# EAGLE design 612_jetracer_328 (EAGLE 9.6.2)
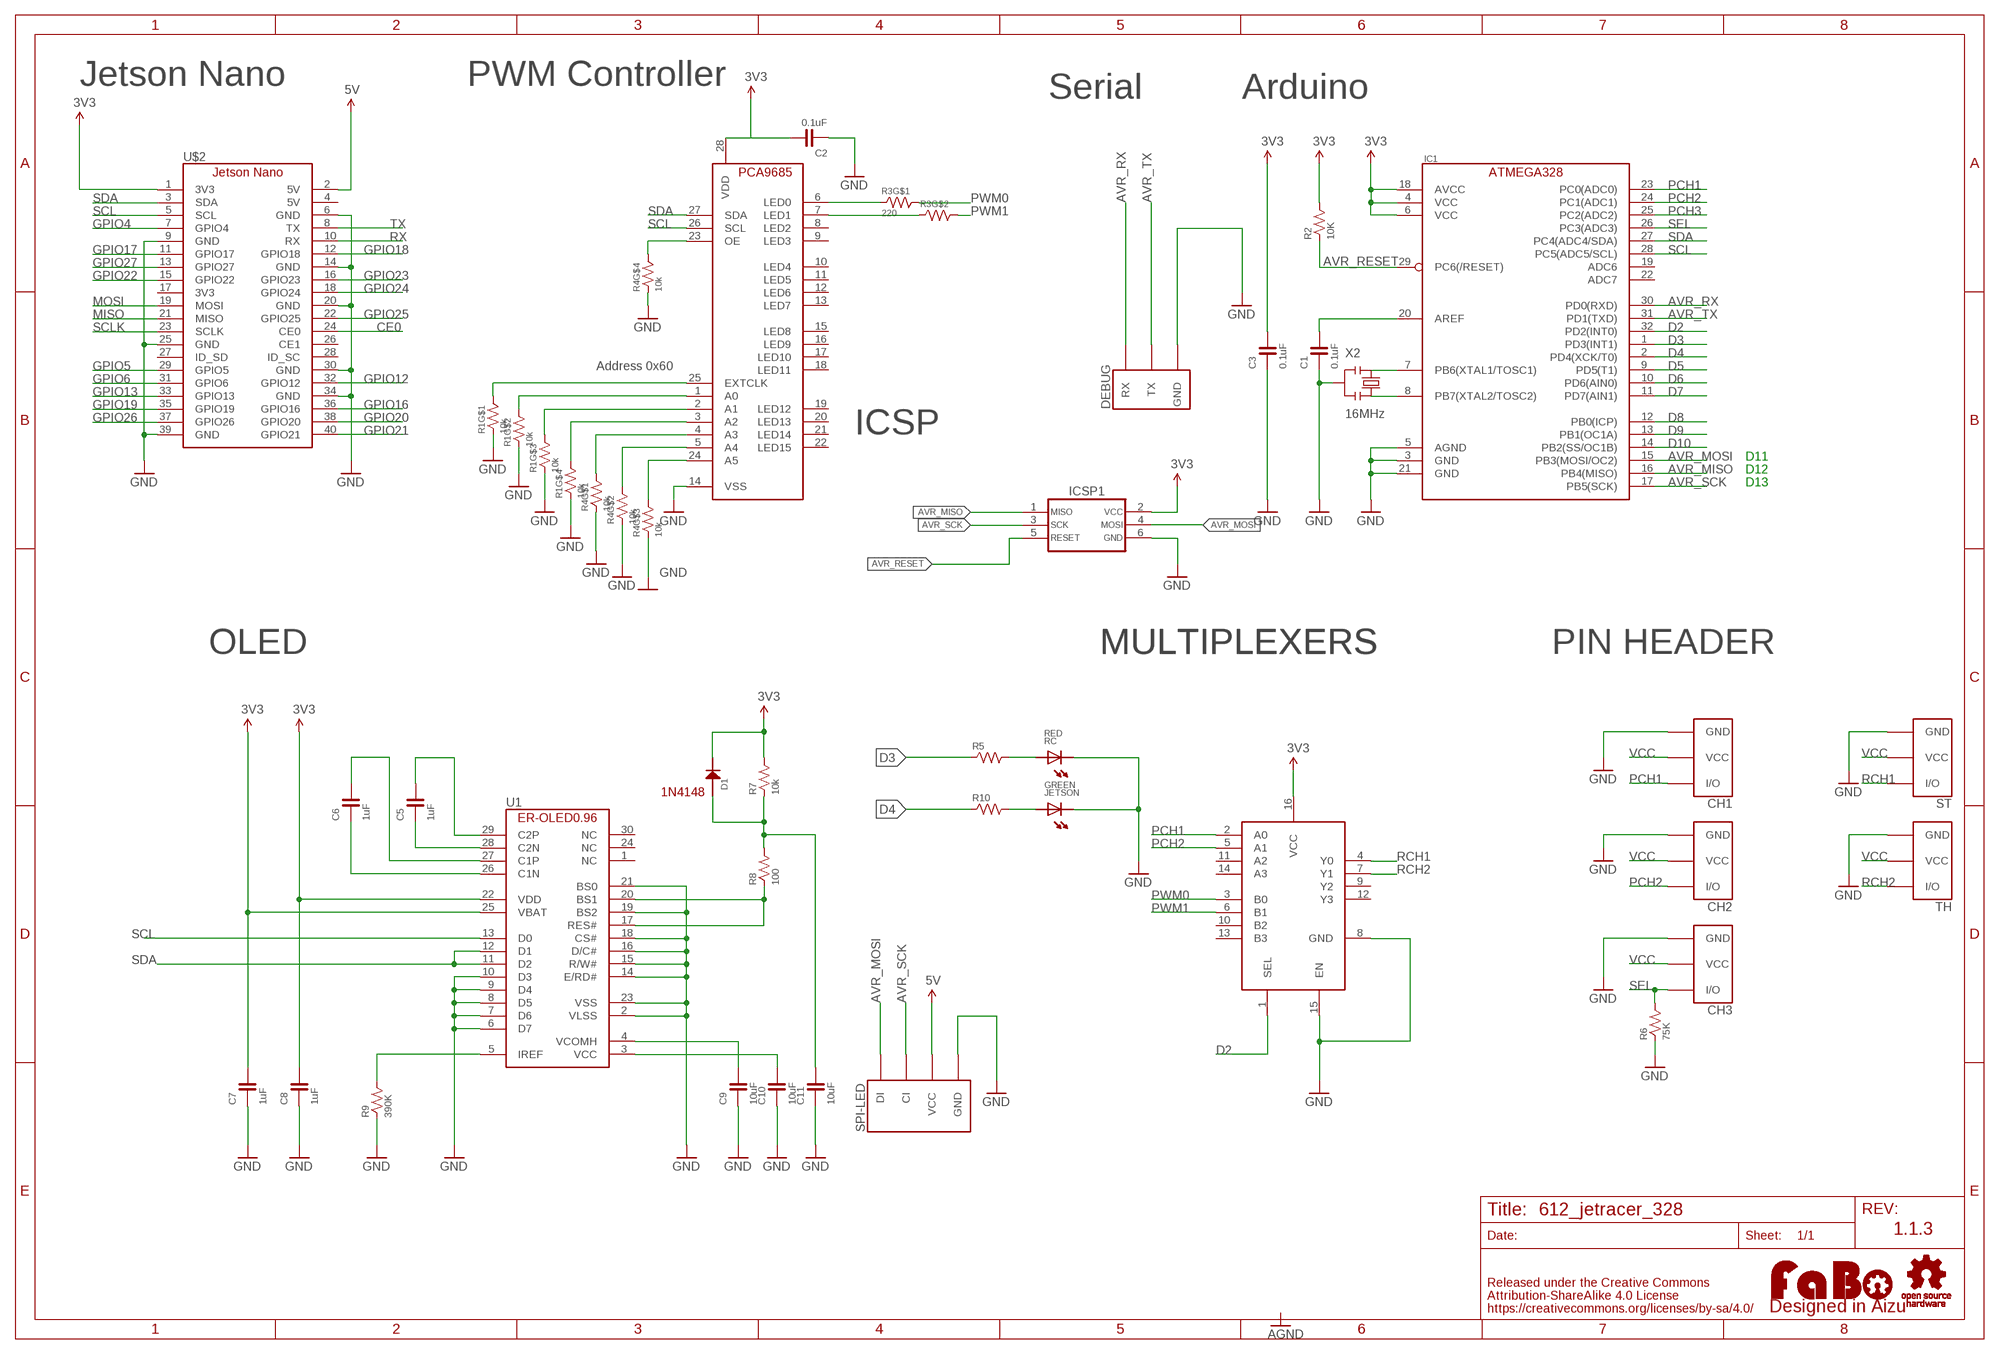
[diagram p0: schematic, sheet 1]

## Parts
C1  0.1uF  CAPACITOR-0603  [0603]
C2  0.1uF  CAPACITOR-0603  [0603]
C3  0.1uF  CAPACITOR-0603  [0603]
C5  1uF  CAPACITOR-0603-BOTTOM  [0603-BOTTOM]
C6  1uF  CAPACITOR-0603-BOTTOM  [0603-BOTTOM]
C7  1uF  CAPACITOR-0603-BOTTOM  [0603-BOTTOM]
C8  1uF  CAPACITOR-0603-BOTTOM  [0603-BOTTOM]
C9  10uF  CAPACITOR-0603-BOTTOM  [0603-BOTTOM]
C10  10uF  CAPACITOR-0603-BOTTOM  [0603-BOTTOM]
C11  10uF  CAPACITOR-0603-BOTTOM  [0603-BOTTOM]
CH1  FABO_BRICK_3PIN-HEADER  [FABO_BRICK_3PIN_HEADER]
CH2  FABO_BRICK_3PIN-HEADER  [FABO_BRICK_3PIN_HEADER]
CH3  FABO_BRICK_3PIN-HEADER  [FABO_BRICK_3PIN_HEADER]
D1  1N4148  [1N4148W]
DEBUG  FABO_BRICK_3PIN_DEBUG  [FABO_BRICK_3PIN_DEBUG]
IC1  ATMEGA328P-AU  [TQFP-32]
IC3  MULTIPLEXERSMC74HC157A  [TSSOP-16]
ICSP1  ICSP_AVR-TC_NOHOLE  [TC2030]
JETSON  GREEN  LED-0603  [0603]
LOGO1  LOGO_FABO-S  [LOGO_FABO_S]
R1  10k  RESISTOR_ARRAY  [EXBV8V]
R2  10K  RESISTOR-0603  [0603]
R3  220  RESISTOR_ARRAY  [EXBV8V]
R4  10k  RESISTOR_ARRAY  [EXBV8V]
R5  220  RESISTOR-0603  [0603]
R6  75K  RESISTOR-0603  [0603]
R7  10k  RESISTOR-0603-BOTTOM  [0603-BOTTOM]
R8  100  RESISTOR-0603-BOTTOM  [0603-BOTTOM]
R9  390K  RESISTOR-0603-BOTTOM  [0603-BOTTOM]
R10  220  RESISTOR-0603  [0603]
RC  RED  LED-0603  [0603]
SPI-LED  FABO-SPI-LED-B04B  [SPI-B04B-PASK-1]
ST  FABO_BRICK_3PIN-HEADER  [FABO_BRICK_3PIN_HEADER]
TH  FABO_BRICK_3PIN-HEADER  [FABO_BRICK_3PIN_HEADER]
U1  ER-OLED0.96-1ER-CON30HT-1  [ER-CON30HT-1]
U$2  JETSON_NANO_NOBORDER  [JETSON_NANO_NOBOARDER]
U$3  PCA9685_BOTTOM  [PCA9685_BOTTOM]
U$7  LOGO_OSHW-M_BOTTOM  [LOGO_OSHW_M_BOTTOM]
X2  16MHz  RESONATOR  [CSTNE_V_C]

## Nets
3V3: C2.2 C3.2 C7.2 D1.CATHODE IC1.4(VCC) IC1.6(VCC) IC1.18(AVCC) IC3.16(VCC) ICSP1.2 R2.2 R7.2 U1.25(VBAT) U$2.1(3V3) U$3.28(VDD)
5V: SPI-LED.VCC U$2.2(5V)
AVR_MISO: IC1.16(PB4(MISO)) ICSP1.1
AVR_MOSI: IC1.15(PB3(MOSI/OC2)) ICSP1.4 SPI-LED.DI
AVR_RESET: IC1.29(PC6(/RESET)) ICSP1.5 R2.1
AVR_RX: DEBUG.RX IC1.30(PD0(RXD))
AVR_SCK: IC1.17(PB5(SCK)) ICSP1.3 SPI-LED.CI
AVR_TX: DEBUG.TX IC1.31(PD1(TXD))
CE0: U$2.24(CE0)
D2: IC1.32(PD2(INT0)) IC3.1(SEL)
D3: IC1.1(PD3(INT1)) R5.1
D4: IC1.2(PD4(XCK/T0)) R10.1
D5: IC1.9(PD5(T1))
D6: IC1.10(PD6(AIN0))
D7: IC1.11(PD7(AIN1))
D8: IC1.12(PB0(ICP))
D9: IC1.13(PB1(OC1A))
D10: IC1.14(PB2(SS/OC1B))
GND: C1.1 C2.1 C3.1 C7.1 C8.1 C9.1 C10.1 C11.1 CH1.GND CH2.GND CH3.GND DEBUG.GND IC1.3(GND) IC1.5(AGND) IC1.21(GND) IC3.8(GND) IC3.15(EN) ICSP1.6 JETSON.CATHODE R1.1 R1.2 R1.3 R1.4 R4.1 R4.2 R4.3 R4.4 R6.1 R9.1 RC.CATHODE SPI-LED.GND ST.GND TH.GND U1.2(VLSS) U1.6(D7) U1.7(D6) U1.8(D5) U1.9(D4) U1.10(D3) U1.14(E/RD#) U1.15(R/W#) U1.16(D/C#) U1.18(CS#) U1.19(BS2) U1.21(BS0) U1.23(VSS) U$2.6(GND) U$2.9(GND) U$2.14(GND) U$2.20(GND) U$2.25(GND) U$2.30(GND) U$2.34(GND) U$2.39(GND) U$3.14(VSS) X2.2
GPIO4: U$2.7(GPIO4)
GPIO5: U$2.29(GPIO5)
GPIO6: U$2.31(GPIO6)
GPIO12: U$2.32(GPIO12)
GPIO13: U$2.33(GPIO13)
GPIO16: U$2.36(GPIO16)
GPIO17: U$2.11(GPIO17)
GPIO18: U$2.12(GPIO18)
GPIO19: U$2.35(GPIO19)
GPIO20: U$2.38(GPIO20)
GPIO21: U$2.40(GPIO21)
GPIO22: U$2.15(GPIO22)
GPIO23: U$2.16(GPIO23)
GPIO24: U$2.18(GPIO24)
GPIO25: U$2.22(GPIO25)
GPIO26: U$2.37(GPIO26)
GPIO27: U$2.13(GPIO27)
MISO: U$2.21(MISO)
MOSI: U$2.19(MOSI)
N$2: R3.1 U$3.6(LED0)
N$3: R3.2 U$3.7(LED1)
N$4: C1.2 IC1.20(AREF)
N$5: IC1.8(PB7(XTAL2/TOSC2)) X2.3
N$7: R4.5 U$3.23(OE)
N$8: R1.8 U$3.25(EXTCLK)
N$9: R1.7 U$3.1(A0)
N$10: R1.6 U$3.2(A1)
N$11: R1.5 U$3.3(A2)
N$12: R4.8 U$3.4(A3)
N$13: R4.7 U$3.5(A4)
N$14: R4.6 U$3.24(A5)
N$15: IC1.7(PB6(XTAL1/TOSC1)) X2.1
N$16: C6.2 U1.27(C1P)
N$19: R5.2 RC.ANODE
N$20: JETSON.ANODE R10.2
N$21: C6.1 U1.26(C1N)
N$22: C5.1 U1.28(C2N)
N$23: C5.2 U1.29(C2P)
N$24: R9.2 U1.5(IREF)
N$25: C9.2 U1.4(VCOMH)
N$26: C10.2 U1.3(VCC)
N$27: R8.1 U1.17(RES#) U1.20(BS1)
N$28: C11.2 D1.ANODE R7.1 R8.2
N$30: C8.2 U1.22(VDD) ; supply symbol labelled 3V3
PCH1: CH1.I/O IC1.23(PC0(ADC0)) IC3.2(A0)
PCH2: CH2.I/O IC1.24(PC1(ADC1)) IC3.5(A1)
PCH3: IC1.25(PC2(ADC2))
PWM0: IC3.3(B0) R3.8
PWM1: IC3.6(B1) R3.7
RCH1: IC3.4(Y0) ST.I/O
RCH2: IC3.7(Y1) TH.I/O
RX: U$2.10(RX)
SCL: IC1.28(PC5(ADC5/SCL)) U1.13(D0) U$2.5(SCL) U$3.26(SCL)
SCLK: U$2.23(SCLK)
SDA: IC1.27(PC4(ADC4/SDA)) U1.11(D2) U1.12(D1) U$2.3(SDA) U$3.27(SDA)
SEL: CH3.I/O IC1.26(PC3(ADC3)) R6.2
TX: U$2.8(TX)
VCC: CH1.VCC CH2.VCC CH3.VCC ST.VCC TH.VCC
Unconnected: IC1.19(ADC6) IC1.22(ADC7) IC3.9(Y2) IC3.10(B2) IC3.11(A2) IC3.12(Y3) IC3.13(B3) IC3.14(A3) R3.3 R3.4 R3.5 R3.6 U1.1(NC) U1.24(NC) U1.30(NC) U$2.4(5V) U$2.17(3V3) U$2.26(CE1) U$2.27(ID_SD) U$2.28(ID_SC) U$3.8(LED2) U$3.9(LED3) U$3.10(LED4) U$3.11(LED5) U$3.12(LED6) U$3.13(LED7) U$3.15(LED8) U$3.16(LED9) U$3.17(LED10) U$3.18(LED11) U$3.19(LED12) U$3.20(LED13) U$3.21(LED14) U$3.22(LED15)

## Notes on the sheet
- Jetson Nano | PWM Controller
- Serial | Arduino
- Address 0x60
- ICSP
- D11
- D12
- D13
- OLED | MULTIPLEXERS | MULTIPLEXERS | PIN HEADER
- 1N4148
- 1.1.3

## Library data of the parts
C1-C3 C5-C11 = FaBo-Capacitor:CAPACITOR: CAPACITOR
CH1-CH3 ST TH = FaBo-Template:FABO_BRICK_3PIN: FaBo Brick 3pin
D1 = FaBo-Diode:1N4148
DEBUG = FaBo-Template:FABO_BRICK_3PIN_DEBUG
IC1 = component:ATMEGA328
IC3 = FaBo-Multiplexers:MULTIPLEXERS
ICSP1 = component:ICSP_AVR
JETSON RC = FaBo-LED:LED
LOGO1 = component:LOGO_FABO
R1 R3 R4 = component:RESISTOR_ARRAY
R2 R5-R10 = FaBo-Resistors:RESISTOR: RESISTOR
SPI-LED = FaBo-Connetor:FABO-SPI-LED
U1 = FaBo-Display:ER-OLED0.96-1
U$2 = FaBo-Boards:JETSON_NANO
U$3 = FaBo-Motor:PCA9685
U$7 = FaBo-Logo:LOGO_OSHW
X2 = component:RESONATOR

## Board
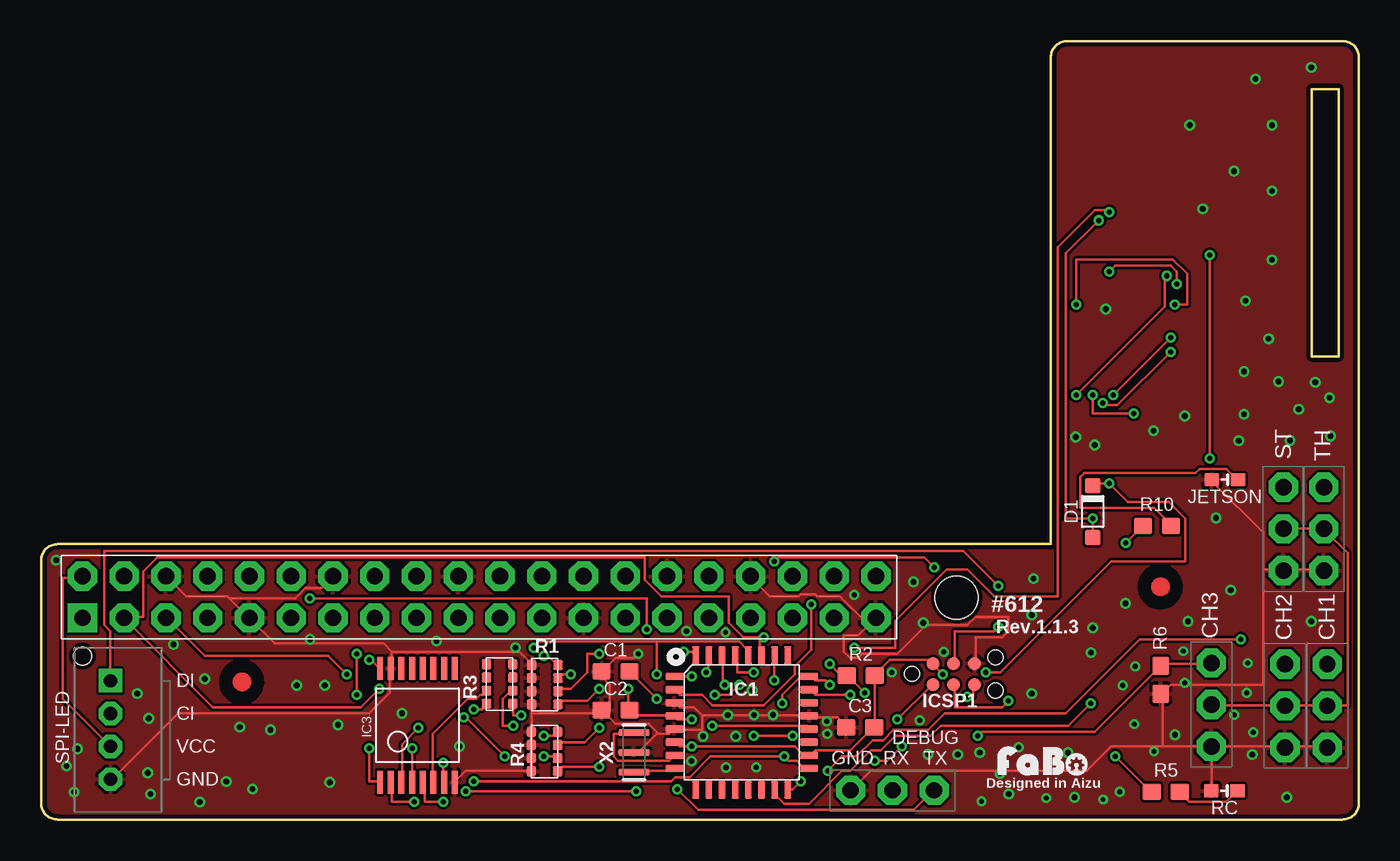
[diagram p1: board, top side]
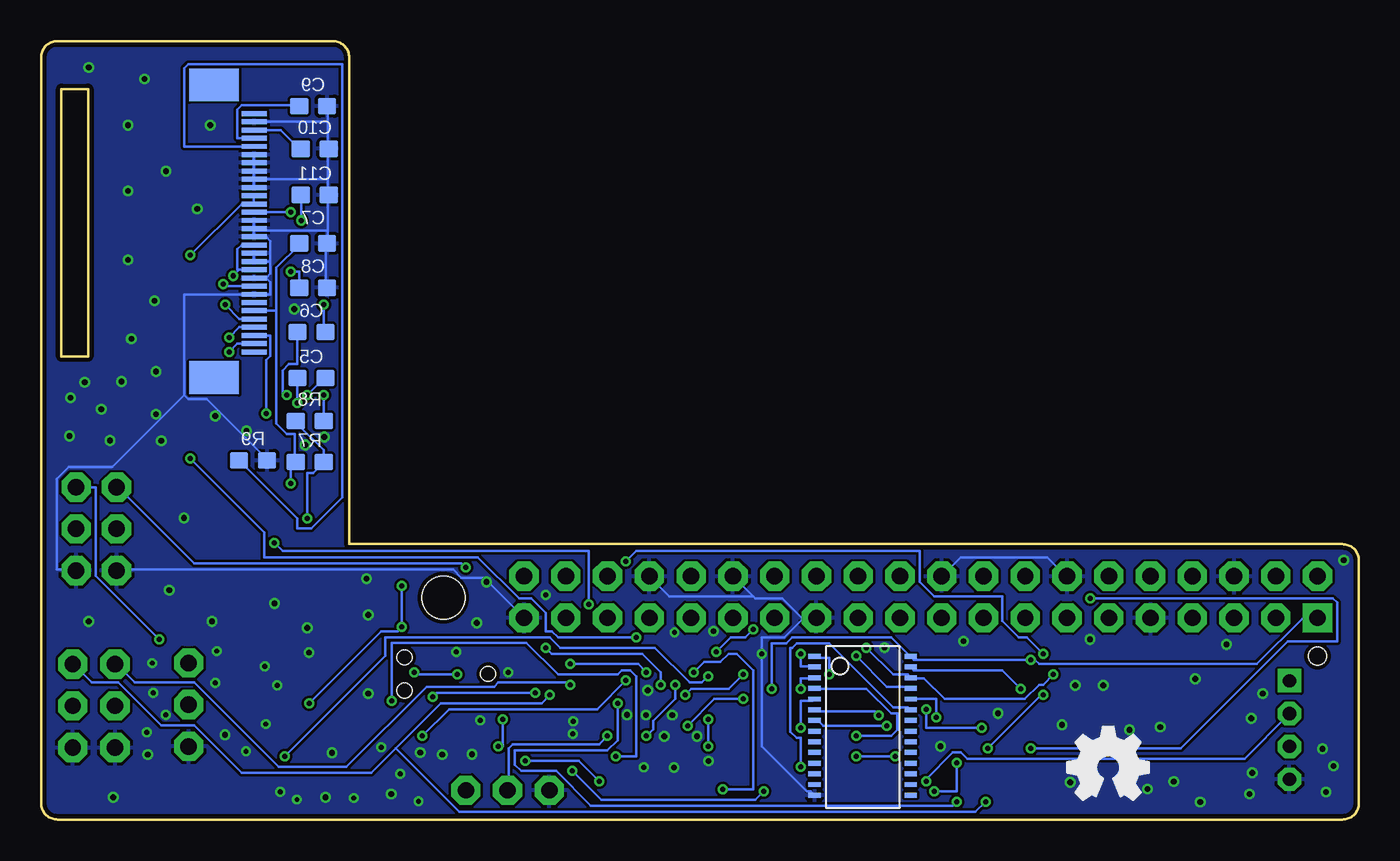
[diagram p2: board, bottom side, seen from below]

Size 80.14 x 47.37 mm. Coordinates in mm from the lower left corner, seen from the top.
Outline: 61.4,16.76 1,16.76 arc90 0,15.76 0,1 arc90 1,0 79.14,0 arc90 80.14,1 80.14,46.37 arc90 79.14,47.37 62.4,47.37 arc90 61.4,46.37 61.4,16.76
Outline: 78.92,28.18 78.92,44.45 77.28,44.45 77.28,28.18 78.92,28.18
Copper layers (1*16): Top 0.035mm / dielectric 1.6mm / Bottom 0.035mm
Design rules "PCBway": minimum track width 6mil, minimum drill 12mil, track to track 6mil, track to pad 6mil, pad to pad 6mil, via to via 6mil, smd to smd 6mil, copper to edge 10mil, drill to drill 10mil, minimum pad ring 10mil, minimum via ring 6mil, stop-mask expansion 2mil, vias tented up to drill 100mil, thermal gap 8mil
Holes 2.6 mm at 55.68,13.51

### Footprints (pad centres in the part's own frame; a part is rotated, then mirrored left to right if it is on the bottom)
0603 = smd 1.1 x 1: 1 -0.85,0; 2 0.85,0
0603-BOTTOM = smd 1.1 x 1 bottom: 1 -0.85,0; 2 0.85,0
FABO_BRICK_3PIN_HEADER = drill 1 pad 1.778 octagon: GND -2.54,0; I/O 2.54,0; VCC 0,0
1N4148W = smd 0.9 x 0.95: ANODE 0,0; CATHODE 3.15,0
FABO_BRICK_3PIN_DEBUG = drill 1 pad 1.778 octagon: GND -2.54,0; RX 0,0; TX 2.54,0
TQFP-32 = smd 1.1 x 0.45: 1 -4.1,2.8; 2 -4.1,2; 3 -4.1,1.2; 4 -4.1,0.4; 5 -4.1,-0.4; 6 -4.1,-1.2; 7 -4.1,-2; 8 -4.1,-2.8; 17 4.1,-2.8; 18 4.1,-2; 19 4.1,-1.2; 20 4.1,-0.4; 21 4.1,0.4; 22 4.1,1.2; 23 4.1,2; 24 4.1,2.8 | smd 0.45 x 1.1: 9 -2.8,-4.1; 10 -2,-4.1; 11 -1.2,-4.1; 12 -0.4,-4.1; 13 0.4,-4.1; 14 1.2,-4.1; 15 2,-4.1; 16 2.8,-4.1; 25 2.8,4.1; 26 2,4.1; 27 1.2,4.1; 28 0.4,4.1; 29 -0.4,4.1; 30 -1.2,4.1; 31 -2,4.1; 32 -2.8,4.1
TSSOP-16 = smd 0.36 x 1.397: 1 -2.275,-3.469; 2 -1.625,-3.469; 3 -0.975,-3.469; 4 -0.325,-3.469; 5 0.325,-3.469; 6 0.975,-3.469; 7 1.625,-3.469; 8 2.271,-3.469; 9 2.275,3.458; 10 1.625,3.458; 11 0.971,3.458; 12 0.325,3.458; 13 -0.325,3.458; 14 -0.975,3.458; 15 -1.625,3.458; 16 -2.275,3.458
TC2030 = smd 0.787 x 0.787: 1 1.27,-0.635; 2 1.27,0.635; 3 2.54,-0.635; 4 2.54,0.635; 5 3.81,-0.635; 6 3.81,0.635 | hole 0.889: 0,0; 5.08,-1.016; 5.08,1.016
0603' = smd 0.9 x 0.8: ANODE -0.8,0; CATHODE 0.8,0
EXBV8V = smd 0.6 x 0.6: 1 -1.2,-0.8; 2 -0.4,-0.8; 3 0.4,-0.8; 4 1.2,-0.8; 5 1.2,0.8; 6 0.4,0.8; 7 -0.4,0.8; 8 -1.2,0.8
SPI-B04B-PASK-1 = drill 0.8 pad 1.422 octagon: CI 1,1.27; GND -3,1.27; VCC -1,1.27 | drill 0.8 pad 1.422 square: DI 3,1.27 | hole 1.1: 4.5,2.97
ER-CON30HT-1 = smd 0.3 x 1.5 bottom: 1 7,-0.23; 2 6.5,-0.23; 3 6,-0.23; 4 5.5,-0.23; 5 5,-0.23; 6 4.5,-0.23; 7 4,-0.23; 8 3.5,-0.23; 9 3,-0.23; 10 2.5,-0.23; 11 2,-0.23; 12 1.5,-0.23; 13 1,-0.23; 14 0.5,-0.23; 15 0,-0.23; 16 -0.5,-0.23; 17 -1,-0.23; 18 -1.5,-0.23; 19 -2,-0.23; 20 -2.5,-0.23; 21 -3,-0.23; 22 -3.5,-0.23; 23 -4,-0.23; 24 -4.5,-0.23; 25 -5,-0.23; 26 -5.5,-0.23; 27 -6,-0.23; 28 -6.5,-0.23; 29 -7,-0.23; 30 -7.5,-0.23 | smd 2 x 3 bottom: 31 -9.07,-2.67; 32 8.74,-2.67
JETSON_NANO_NOBOARDER = drill 1 pad 1.778 square: 1 1.27,1.27 | drill 1 pad 1.778 octagon: 2 1.27,3.81; 3 3.81,1.27; 4 3.81,3.81; 5 6.35,1.27; 6 6.35,3.81; 7 8.89,1.27; 8 8.89,3.81; 9 11.43,1.27; 10 11.43,3.81; 11 13.97,1.27; 12 13.97,3.81; 13 16.51,1.27; 14 16.51,3.81; 15 19.05,1.27; 16 19.05,3.81; 17 21.59,1.27; 18 21.59,3.81; 19 24.13,1.27; 20 24.13,3.81; 21 26.67,1.27; 22 26.67,3.81; 23 29.21,1.27; 24 29.21,3.81; 25 31.75,1.27; 26 31.75,3.81; 27 34.29,1.27; 28 34.29,3.81; 29 36.83,1.27; 30 36.83,3.81; 31 39.37,1.27; 32 39.37,3.81; 33 41.91,1.27; 34 41.91,3.81; 35 44.45,1.27; 36 44.45,3.81; 37 46.99,1.27; 38 46.99,3.81; 39 49.53,1.27; 40 49.53,3.81
PCA9685_BOTTOM = smd 0.3 x 0.75 bottom: 1 4.3,-2.93; 2 3.65,-2.93; 3 3,-2.93; 4 2.35,-2.93; 5 1.7,-2.93; 6 1.05,-2.93; 7 0.4,-2.93; 8 -0.25,-2.93; 9 -0.9,-2.93; 10 -1.55,-2.93; 11 -2.2,-2.93; 12 -2.85,-2.93; 13 -3.5,-2.93; 14 -4.15,-2.93; 15 -4.15,2.92; 16 -3.5,2.92; 17 -2.85,2.92; 18 -2.2,2.92; 19 -1.55,2.92; 20 -0.9,2.92; 21 -0.25,2.92; 22 0.4,2.92; 23 1.05,2.92; 24 1.7,2.92; 25 2.35,2.92; 26 3,2.92; 27 3.65,2.92; 28 4.3,2.92
CSTNE_V_C = smd 0.4 x 1.9: 1 1.2,0; 2 0,0; 3 -1.2,0

### Placement (x,y rotation side)
C1  34.93,9.02 0 top
C2  34.94,6.66 0 top
C3  49.81,5.61 0 top
C5  63.7,26.86 0 top
C6  63.7,29.66 0 top
C7  63.6,35.06 0 top
C8  63.6,32.36 0 top
C9  63.6,43.41 0 top
C10  63.5,40.81 0 top
C11  63.5,38.01 0 top
CH1  78.22,6.92 90 top
CH2  75.64,6.92 90 top
CH3  71.17,6.99 90 top
D1  63.95,17.16 90 top
DEBUG  51.77,1.78 0 top
IC1  42.61,5.91 0 top
IC3  22.89,5.75 0 top
ICSP1  52.96,8.86 0 top
JETSON  GREEN  [0603']  71.99,20.68 180 top
LOGO1  60.96,2.54 0 top
R1  30.63,8.21 270 top
R2  49.85,8.76 0 top
R3  27.89,8.25 90 top
R4  30.61,4.14 270 top
R5  68.4,1.69 0 top
R6  68.09,8.5 90 top
R7  63.8,21.76 0 top
R8  63.8,24.26 0 top
R9  67.25,21.86 0 top
R10  67.86,17.87 0 top
RC  RED  [0603']  71.96,1.75 180 top
SPI-LED  5.49,5.45 90 top
ST  75.55,17.69 90 top
TH  78.01,17.69 90 top
U1  66.95,35.96 90 top
U$2  1.24,11 0 top
U$3  30.17,5.63 90 top
U$4  [MARK_POINT_3MM]  12.21,8.38 0 top
U$6  [MARK_POINT_3MM]  68.08,14.16 0 top
U$7  15.24,3.17 0 top
X2  36.05,4.08 90 top

### Tracks (layer width: path | path; a pad name or v marks a point on that pad's centre or on a via)
3V3  (via drill 0.3)
  Top 0.152: v19.95,9.71 20.07,9.71 20.57,9.21 IC3.16 | v35.7,7.96 35.7,6.71 C2.2 35.83,6.58 36.08,6.33 38.45,6.33 IC1.4 38.58,6.21 38.7,6.08 v39.58,6.08 | D1.CATHODE 63.95,20.34 64.08,20.46 v64.95,20.46 66.08,19.34 68.58,19.34 69.58,18.34 69.58,15.71 65.08,15.71 58.33,8.96 v57.45,8.96 | IC1.6 38.58,4.71 38.83,4.46 v39.58,4.46 45.83,4.46 46.33,3.96 46.7,3.96 IC1.18 46.83,3.96 47.08,4.21 49.2,4.21 50.58,5.58 C3.2 50.7,5.71 R2.2 50.7,8.84 51.59,9.73 54.06,9.73 54.2,9.59 ICSP1.2 54.2,9.46 v54.83,8.84
  Bottom 0.152: U$2.1 2.57,12.21 3.45,12.21 6.2,9.46 19.45,9.46 19.7,9.71 v19.95,9.71 27.07,9.71 27.2,9.84 U$3.28 27.32,9.96 28.45,11.09 34.45,11.09 34.83,10.71 35.7,10.71 v35.7,7.96 | v64.95,20.46 64.95,21.71 64.7,21.71 R7.2 64.7,21.84 64.7,23.46 65.2,23.46 65.83,24.09 65.83,30.96 | 65.83,30.96 65.83,33.59 64.45,34.96 C7.2 | U1.25 65.83,30.96 | v57.45,8.96 57.33,8.84 v54.83,8.84 | v39.58,4.46 v39.58,6.08
5V
  Top 0.152: SPI-LED.VCC 4.2,4.46 1.32,7.33 1.32,14.71 2.45,14.71 U$2.2
AVR_MISO  (via drill 0.3)
  Top 0.152: v52.08,6.08 54.2,8.21 ICSP1.1 | v52.33,4.46 51.45,3.58 v50.7,3.58 | v46.2,2.33 45.7,1.83 45.45,1.83 IC1.16
  Bottom 0.152: v52.08,6.08 52.08,4.46 v52.33,4.46 | v50.7,3.58 47.45,3.58 v46.2,2.33
AVR_MOSI  (via drill 0.3)
  Top 0.152: v58.2,11.71 57.95,11.46 55.58,11.46 55.58,9.59 ICSP1.4 | v63.83,7.08 62.45,5.71 54.7,5.71 54.08,5.08 51.95,5.08 51.08,4.21 50.45,4.21 49.2,2.96 48.7,2.96 46.7,0.96 45.2,0.96 44.7,1.46 44.7,1.71 IC1.15 | v58.2,14.21 56.08,16.34 3.82,16.34 3.82,11.84 4.2,11.46 4.2,8.46 SPI-LED.DI
  Bottom 0.152: v63.83,7.08 59.45,11.46 58.45,11.46 v58.2,11.71 v58.2,14.21
AVR_RESET  (via drill 0.3)
  Top 0.152: v56.33,7.46 56.7,7.46 56.7,8.21 ICSP1.5 | v50.08,7.71 49.08,8.71 R2.1 48.95,8.84 48.58,8.84 v47.95,9.46 | v43.33,8.96 42.33,8.96 42.33,9.96 IC1.29
  Bottom 0.152: v56.33,7.46 56.08,7.71 v50.08,7.71 | v43.33,8.96 43.83,9.46 v47.95,9.46
AVR_RX  (via drill 0.3)
  Top 0.152: v41.58,8.21 41.45,8.21 41.45,9.96 IC1.30 | v45.7,5.08 v43.33,5.08
  Bottom 0.152: v41.58,8.21 41.58,7.34 42.91,6.01 42.91,5.5 v43.33,5.08 | v45.7,5.08 46.2,4.58 51.45,4.58 51.7,4.33 51.7,1.83 DEBUG.RX
AVR_SCK  (via drill 0.3)
  Top 0.152: v58.83,7.21 58.45,6.83 55.58,6.83 55.58,8.21 ICSP1.3 | IC1.17 46.7,3.21 46.33,3.21 45.95,3.58 45.45,3.58 v45.2,3.83 40.7,3.83 39.45,2.58 38.58,2.58 38.33,2.33 v26.32,2.33
  Bottom 0.152: v58.83,7.21 58.83,10.76 50.62,10.76 48.7,8.84 45.08,8.84 44.83,9.09 44.33,9.09 43.95,8.71 43.95,3.83 v45.2,3.83 | v26.32,2.33 26.32,2.46 24.7,4.08 24.2,4.08 23.82,3.71 6.95,3.71 4.32,6.33 SPI-LED.CI
AVR_TX  (via drill 0.3)
  Top 0.152: v40.45,8.96 40.58,8.96 40.58,9.96 IC1.31 | v38.7,1.83 39.95,0.58 53.08,0.58 54.2,1.71 DEBUG.TX
  Bottom 0.152: v40.45,8.96 39.83,9.59 38.83,9.59 38.33,10.09 37.83,10.09 36.83,9.09 36.83,1.83 v38.7,1.83
D2  (via drill 0.3)
  Top 0.152: v39.08,10.21 39.58,10.21 39.7,10.09 IC1.32 | v36.83,11.59 36.83,13.46 v16.32,13.46 | v19.95,4.33 19.95,2.33 20.57,2.33 IC3.1
  Bottom 0.152: v39.08,10.21 38.2,11.09 37.33,11.09 v36.83,11.59 | v16.32,13.46 1.57,13.46 1.32,13.21 1.32,10.84 4.32,10.84 10.82,4.33 v19.95,4.33
D3  (via drill 0.3)
  Top 0.152: v65.33,3.83 67.45,1.71 R5.1 | IC1.1 v39.58,8.71
  Bottom 0.152: v65.33,3.83 59.2,9.96 59.2,11.09 49.2,11.09 48.58,10.46 42.83,10.46 40.7,8.34 39.95,8.34 v39.58,8.71
D4  (via drill 0.3)
  Top 0.152: v46.83,13.09 46.83,10.34 45.83,9.34 45.83,8.84 43.95,6.96 40.83,6.96 40.2,7.58 38.83,7.58 38.58,7.83 IC1.2 | v65.95,16.84 66.95,17.84 R10.1
  Bottom 0.152: v46.83,13.09 46.83,16.34 65.45,16.34 v65.95,16.84
GND  (via drill 0.3, 0.35)
  Top 0.152: 50.33,11.84 50.7,12.21 U$2.39 50.33,11.84 | 50.33,11.84 49.7,11.21 48.83,11.21 48.83,10.21 49.2,9.84 49.7,9.84 49.95,10.09 52.08,10.09 53.83,11.84 56.33,11.84 56.83,12.34 58.83,12.34 58.83,11.46 58.45,11.09 56.83,11.09 56.83,9.59 ICSP1.6 | 50.33,11.84 48.58,13.59 47.2,13.59 47.08,13.71 46.2,13.71 46.08,13.59 44.33,13.59 43.2,14.71 U$2.34 | 11.45,13.46 11.32,13.59 8.82,13.59 7.7,14.71 U$2.6 | 11.45,13.46 12.57,12.34 U$2.9 12.7,12.21 14.2,10.71 20.82,10.71 21.32,10.21 | 11.45,13.46 15.45,13.46 16.07,14.09 17.07,14.09 17.7,14.71 U$2.14 | C3.1 48.95,5.71 48.45,6.21 46.83,6.21 IC1.21 46.7,6.33 40.2,6.33 | 37.58,5.21 37.45,5.21 36.33,4.08 X2.2 | 37.58,5.21 38.2,5.21 38.45,5.46 IC1.5 38.58,5.46 40.2,5.46 40.2,6.33 | 37.58,5.21 36.95,5.83 34.95,5.83 34.2,6.58 C2.1 | 40.2,6.33 39.7,6.83 38.83,6.83 38.58,7.08 IC1.3 | C2.1 34.2,6.71 34.58,6.71 34.58,8.21 34.2,8.59 34.2,8.96 C1.1 34.2,9.09 34.95,9.84 36.08,9.84 v36.33,10.09 | IC3.8 25.2,2.33 25.82,2.96 29.7,2.96 R4.4 29.82,2.96 29.82,3.71 R4.3 29.82,3.83 29.82,4.46 R4.2 29.82,4.58 29.82,5.33 R4.1 29.82,5.46 29.82,6.46 | 21.32,10.21 21.32,9.21 IC3.15 21.2,9.09 21.2,7.71 19.95,6.46 8.32,6.46 4.32,2.46 SPI-LED.GND | 21.32,10.21 29.07,10.21 29.82,9.46 R1.1 29.82,9.34 29.82,8.71 R1.2 29.82,8.59 29.82,7.83 R1.3 29.82,7.71 29.82,7.08 R1.4 29.82,6.96 29.82,6.46 | 29.82,6.46 33.95,6.46 34.08,6.58 C2.1 | 74.33,15.21 74.33,17.46 71.2,20.59 JETSON.CATHODE | 74.33,15.21 75.45,15.21 ST.GND 75.58,15.21 77.95,15.21 TH.GND | CH1.GND 78.2,4.46 75.7,4.46 CH2.GND 75.58,4.46 71.2,4.46 CH3.GND | RC.CATHODE 71.2,1.83 71.2,4.33 CH3.GND
  Top 0.152: 68.2,4.46 68.2,7.58 R6.1 68.2,7.71 68.7,8.21 74.33,8.21 74.33,15.21 | 68.2,4.46 71.08,4.46 CH3.GND | 68.2,4.46 65.08,4.46 63.58,2.96 50.45,2.96 49.33,1.83 DEBUG.GND
  Bottom 0.152: 33.83,12.21 34.95,11.09 36.33,11.09 v36.33,10.09 36.33,4.46 33.58,1.71 33.33,1.71 33.2,1.58 U$3.14 | 33.83,12.21 33.08,12.21 U$2.25 33.83,12.21 | 36.83,13.59 36.7,13.46 35.08,13.46 33.83,12.21 | 36.83,13.59 37.95,14.71 U$2.30 | 36.83,13.59 41.95,13.59 43.08,14.71 U$2.34 | U$2.20 25.32,14.84 24.2,15.96 18.95,15.96 17.82,14.84 U$2.14 | 67.2,38.96 67.2,38.46 U1.10 | 67.2,39.96 67.2,39.46 | 67.2,39.96 67.2,40.46 U1.6 | 67.2,39.96 U1.7 | 67.2,39.46 67.2,38.96 | 67.2,38.96 U1.9 62.7,38.96 | 67.2,39.46 U1.8 | C8.1 62.83,32.46 62.83,34.96 C7.1 62.7,35.09 62.7,35.84 | 62.7,38.96 62.7,40.71 C10.1 62.7,40.84 62.7,42.46 | 62.7,38.96 62.7,38.09 C11.1 62.7,37.96 62.7,35.84 | 62.7,42.46 62.7,43.34 C9.1 | 62.7,42.46 U1.2 | 67.2,35.96 67.2,35.84 | 67.2,35.84 67.2,35.46 U1.16 66.45,35.46 66.2,35.21 66.2,33.96 | 67.2,35.96 67.2,36.46 U1.14 | 67.2,35.96 U1.15 67.2,35.84 | 66.45,32.96 U1.21 67.08,32.96 | 66.45,32.96 66.2,33.21 66.2,33.96 | 66.2,33.96 U1.19 67.2,33.96 67.2,34.46 U1.18 | 71.45,25.84 71.2,25.59 70.08,25.59 66.45,21.96 R9.1 | 71.45,25.84 71.45,31.96 U1.23 66.2,31.96 66.2,32.71 66.45,32.96 | 67.2,35.84 62.7,35.84 | 71.45,25.84 75.83,21.46 78.45,21.46 79.2,20.71 79.2,15.21 78.08,15.21 TH.GND | U$2.39 50.83,12.34 53.2,14.71 54.58,14.71 55.08,15.21 75.45,15.21 ST.GND
  other vias: 13.95,5.46 6.55,6.16 12.85,1.86 15.55,8.16 21.95,6.46 25.45,4.46 55.75,3.96 58.85,1.56 62.45,4.06 63.95,11.66 60.25,12.46 60.25,7.66 72.35,13.96 77.25,12.06 75.75,1.36 73.65,3.96 68.95,5.16 69.85,42.26 73.85,45.06 77.25,45.76 74.85,42.26 72.55,39.46 74.85,38.26 70.65,37.16 74.85,34.06 73.25,31.56 74.65,29.26 64.75,31.06 73.15,27.26 75.25,26.66 78.35,25.66 73.15,24.66 69.55,24.56 67.65,23.66 71.45,18.36 75.95,23.06 69.75,12.06 65.95,13.16 63.85,10.16 60.35,14.66 53.65,11.96 53.05,14.46 62.85,1.36 17.55,2.26 18.05,5.76 17.25,8.16 9.95,8.56 8.05,10.66 5.85,7.66 1.55,3.26 6.65,1.56 9.65,1.06 24.05,10.86 16.35,10.96 28.85,10.46 40.25,5.06 41.65,3.16 42.25,5.06 41.75,6.36 39.55,3.56 44.51,6.38 43.25,7.86 43.35,6.36 41.62,11.38 39.25,11.46 43.48,3.19 47.78,5.99 47.81,5.23 54.9,10.2 49.45,13.66 51.72,8.95 53.44,6.05 59.45,4.39 61.14,1.31 57.19,1.1 58.29,2.79 65.59,1.7 64.58,1.22 67.68,4.16 66.47,5.81 65.79,8.17 66.55,9.32 69.55,8.32 69.45,10.25 73.37,9.52 73.33,7.72 72.55,6.36 73.72,5.31 76.49,24.97 77.49,26.61 78.41,23.34 72.84,23.05 64.08,22.8 62.92,23.28 12.08,5.63 11.26,2.31 6.48,2.84 2.21,4.31 2,1.68 0.92,15.78 53.93,3.97 57.09,4.07
  pour Top: 0,-1.27 0,48.26 81.28,48.26 81.28,-1.27
  pour Bottom: 0,-1.27 0,48.26 81.28,48.26 81.28,-1.27 1.27,-1.27
N$2  (via drill 0.3)
  Top 0.152: v29.2,6.33 28.7,6.33 28.7,6.96 R3.1
  Bottom 0.152: v29.2,6.33 29.45,6.58 33.08,6.58 U$3.6
N$3  (via drill 0.3)
  Top 0.152: v28.7,5.71 28.07,5.71 28.07,7.33 28.57,7.83 R3.2
  Bottom 0.152: v28.7,5.71 32.58,5.71 32.83,5.96 33.08,5.96 U$3.7
N$4  (via drill 0.3)
  Top 0.152: v40.83,5.71 46.58,5.71 46.7,5.58 IC1.20 | v37.45,7.33 35.83,8.96 C1.2
  Bottom 0.152: v40.83,5.71 39.2,7.33 v37.45,7.33
N$5
  Top 0.152: IC1.8 38.45,3.08 38.33,2.96 36.08,2.96 X2.3
N$7  (via drill 0.3)
  Top 0.152: v33.95,3.21 31.7,3.21 31.45,2.96 R4.5
  Bottom 0.152: v33.95,3.21 33.95,4.96 34.2,4.96 34.58,5.33 34.58,10.46 34.45,10.46 34.2,10.71 32.2,10.71 28.32,6.83 27.45,6.83 27.32,6.71 U$3.23
N$8  (via drill 0.3)
  Top 0.152: v30.57,9.96 30.82,9.96 31.32,9.46 R1.8
  Bottom 0.152: v30.57,9.96 28.7,8.09 27.32,8.09 U$3.25
N$9  (via drill 0.3)
  Top 0.152: v32.2,8.84 31.57,8.84 31.45,8.71 R1.7
  Bottom 0.152: v32.2,8.84 32.2,9.84 33.08,9.84 U$3.1
N$10  (via drill 0.3)
  Top 0.152: v33.95,10.09 33.2,10.09 33.2,8.96 32.2,7.96 31.57,7.96 31.45,7.83 R1.6
  Bottom 0.152: v33.95,10.09 33.95,9.34 33.2,9.34 U$3.2
N$11  (via drill 0.3)
  Top 0.152: v33.95,7.96 33.2,7.21 31.57,7.21 31.45,7.08 R1.5
  Bottom 0.152: v33.95,7.96 33.95,8.59 33.2,8.59 U$3.3
N$12  (via drill 0.3)
  Top 0.152: v30.57,5.08 31.07,5.08 31.32,5.33 R4.8
  Bottom 0.152: v30.57,5.08 28.45,5.08 28.07,5.46 28.07,6.46 28.45,6.46 29.95,7.96 33.08,7.96 U$3.4
N$13  (via drill 0.3)
  Top 0.152: v33.95,5.58 33.08,4.71 31.57,4.71 31.45,4.58 R4.7
  Bottom 0.152: v33.95,5.58 33.95,7.21 33.2,7.21 U$3.5
N$14  (via drill 0.3)
  Top 0.152: v30.57,3.83 31.32,3.83 R4.6 | v28.2,3.83 25.82,6.21 v25.7,6.21
  Bottom 0.152: v28.2,3.83 v30.57,3.83 | v25.7,6.21 25.7,7.33 27.2,7.33 U$3.24
N$15
  Top 0.152: IC1.7 38.45,3.83 38.2,3.58 35.08,3.58 34.83,3.83 34.83,5.21 35.95,5.21 X2.1
N$16  (via drill 0.3)
  Top 0.152: v68.7,29.34 v65.2,25.84
  Bottom 0.152: v65.2,25.84 65.45,25.84 65.45,27.34 65.08,27.71 64.58,27.71 64.58,29.59 C6.2 | v68.7,29.34 68.08,29.96 U1.27
N$19
  Top 0.152: RC.ANODE 72.7,1.71 72.08,1.08 69.83,1.08 69.33,1.58 R5.2
N$20
  Top 0.152: JETSON.ANODE 72.7,20.71 72.08,21.34 70.45,21.34 70.2,21.09 63.45,21.09 63.2,20.84 63.2,18.96 67.7,18.96 68.7,17.96 R10.2
N$21  (via drill 0.3)
  Top 0.152: v62.95,31.34 62.95,34.09 68.83,34.09 69.7,33.21 69.7,31.34 v68.95,31.34
  Bottom 0.152: v62.95,31.34 62.95,29.71 C6.1 | v68.95,31.34 68.08,30.46 U1.26
N$22  (via drill 0.3)
  Top 0.152: v63.95,25.84 63.95,24.71 v66.45,24.71
  Bottom 0.152: v63.95,25.84 62.95,26.84 C5.1 | v66.45,24.71 66.45,27.96 66.2,28.21 66.2,29.46 U1.28
N$23  (via drill 0.3)
  Top 0.152: v64.58,25.34 64.7,25.21 65.45,25.21 v68.7,28.46
  Bottom 0.152: v64.58,25.34 64.58,26.84 C5.2 | v68.7,28.46 68.2,28.96 U1.29
N$24
  Bottom 0.152: R9.2 64.58,18.34 64.58,17.71 63.7,17.71 61.83,19.59 61.83,45.96 71.2,45.96 71.45,45.71 71.45,40.96 U1.5
N$25
  Bottom 0.152: U1.4 68.2,41.46 68.2,43.21 67.95,43.46 64.45,43.46 C9.2
N$26
  Bottom 0.152: U1.3 65.58,41.96 64.45,40.84 C10.2
N$27  (via drill 0.3)
  Top 0.152: v62.95,25.84 68.33,31.21 68.33,33.09 v68.45,33.09
  Bottom 0.152: v62.95,25.84 R8.1 | 68.08,33.46 v68.45,33.09 | U1.20 68.08,33.46 | U1.17 67.95,34.96 68.2,34.71 68.2,33.46 68.08,33.46
N$28  (via drill 0.3)
  Top 0.152: D1.ANODE v63.95,18.34 62.33,18.34 62.33,34.46 v64.33,36.46
  Bottom 0.152: v63.95,18.34 63.95,21.09 63.58,21.09 62.95,21.71 R7.1 62.95,22.48 64.65,24.18 R8.2 | v64.33,36.46 64.33,37.96 C11.2
N$30  (via drill 0.3)
  Top 0.152: v64.95,33.34 65.33,33.71 68.7,33.71 69.08,33.34 v69.08,32.59
  Bottom 0.152: C8.2 64.45,33.34 v64.95,33.34 | v69.08,32.59 68.95,32.46 U1.22
PCH1  (via drill 0.3)
  Top 0.152: v49.2,7.58 47.08,7.58 46.83,7.83 IC1.23 | v22.7,1.08 21.32,1.08 21.32,2.21 IC3.2
  Bottom 0.152: v49.2,7.58 49.7,7.08 55.83,7.08 58.58,4.33 | 58.58,4.33 60.08,2.83 67.95,2.83 70.84,5.73 72.84,5.73 75.45,8.34 77.08,8.34 78.2,9.46 CH1.I/O | v22.7,1.08 23.32,0.46 54.7,0.46 58.58,4.33
PCH2  (via drill 0.3)
  Top 0.152: v47.95,8.21 47.7,8.46 47.08,8.46 46.83,8.71 IC1.24 46.2,8.71 45.08,7.58 v45.08,7.08 | v24.45,1.08 23.32,1.08 23.32,2.21 IC3.5
  Bottom 0.152: v47.95,8.21 48.08,8.34 52.33,8.34 52.58,8.09 56.7,8.09 61.58,3.21 65.7,3.21 70.83,8.34 74.45,8.34 75.58,9.46 CH2.I/O | v24.45,1.08 24.7,0.83 46.7,0.83 48.83,2.96 50.95,2.96 51.33,3.33 51.33,4.21 45.7,4.21 45.08,4.83 v45.08,7.08
PWM0  (via drill 0.3)
  Top 0.152: v26.32,6.71 26.82,6.71 27.07,6.96 R3.8 | v22.95,5.58 21.95,4.58 21.95,2.33 IC3.3
  Bottom 0.152: v26.32,6.71 26.32,5.58 v22.95,5.58
PWM1
  Top 0.152: R3.7 27.07,7.83 26.82,7.58 26.7,7.58 26.45,7.33 25.95,7.33 23.82,5.21 23.82,2.33 IC3.6
RCH1  (via drill 0.3)
  Top 0.152: v22.57,4.33 22.57,2.33 IC3.4 | v19.2,10.09 v19.2,7.58 | v44.58,15.71 44.83,15.96 53.7,15.96 v54.33,15.34
  Bottom 0.152: v22.57,4.33 19.32,7.58 v19.2,7.58 | v19.2,10.09 20.2,11.09 20.7,11.09 21.7,12.09 21.7,13.59 25.82,13.59 26.7,14.46 26.7,16.34 43.95,16.34 v44.58,15.71 | v54.33,15.34 54.58,15.59 70.83,15.59 75.45,20.21 ST.I/O
RCH2  (via drill 0.3)
  Top 0.152: v24.45,3.46 24.45,2.33 IC3.7 | v36.2,1.71 v25.82,1.71 | v47.83,2.96 48.7,3.83 49.58,3.83 50.58,4.83 51.2,4.83 51.83,5.46 53.95,5.46 54.95,6.46 62.33,6.46 66.83,10.96 v72.95,10.96
  Bottom 0.152: v24.45,3.46 24.45,1.71 v25.82,1.71 | v36.2,1.71 36.7,1.21 46.08,1.21 v47.83,2.96 | v72.95,10.96 76.83,14.84 76.83,20.21 77.95,20.21 TH.I/O
SCL  (via drill 0.3)
  Top 0.152: v29.95,10.46 30.32,10.84 37.45,10.84 | 37.45,10.84 42.45,10.84 42.95,10.34 42.95,10.09 IC1.28 | v64.95,36.96 64.83,37.09 64.08,37.09 61.83,34.84 61.83,13.59 57.95,13.59 56.33,15.21 55.08,15.21 51.95,12.09 51.95,10.46 v49.45,10.46 | v42.45,8.21 41.83,7.58 v40.97,7.58 | 37.45,10.84 v37.45,8.84 | v18.57,8.84 17.45,9.96 9.95,9.96 7.7,12.21 U$2.5
  Bottom 0.152: v29.95,10.46 28.32,8.84 27.45,8.84 27.32,8.71 U$3.26 27.2,8.59 26.45,8.59 25.2,7.33 20.32,7.33 19.45,8.21 19.2,8.21 v18.57,8.84 | v64.95,36.96 U1.13 | v49.45,10.46 49.08,10.09 43.58,10.09 42.45,8.96 v42.45,8.21 | v40.97,7.58 40.6,7.96 38.33,7.96 v37.45,8.84
SDA  (via drill 0.3)
  Top 0.152: v20.57,7.96 19.45,6.83 10.45,6.83 5.07,12.21 U$2.3 5.07,12.34 6.2,12.34 6.2,15.09 7.07,15.96 36.7,15.96 36.7,14.59 37.7,13.59 41.83,13.59 41.83,11.96 42.7,11.09 43.7,11.09 | 43.7,11.09 43.7,10.09 IC1.27 | v71.08,21.96 v71.08,34.34 | 43.7,11.09 v43.95,11.09
  Bottom 0.152: 67.2,37.46 67.2,37.96 U1.11 | v20.57,7.96 21.7,9.09 27.07,9.09 27.2,9.21 U$3.27 | 67.2,37.46 67.95,37.46 v71.08,34.34 | v71.08,21.96 66.58,17.46 66.58,15.96 53.58,15.96 51.08,13.46 50.33,13.46 49.45,12.59 49.45,11.46 49.08,11.46 48.7,11.09 v43.95,11.09 | 67.2,37.46 U1.12
SEL  (via drill 0.3)
  Top 0.152: CH3.I/O 71.08,9.46 68.2,9.46 R6.2 64.08,5.33 57.2,5.33 v56.95,5.08 | v44.58,8.46 44.58,9.96 IC1.26
  Bottom 0.152: v44.58,8.46 46.33,6.71 55.33,6.71 v56.95,5.08
VCC
  Top 0.152: ST.VCC 75.58,17.71 77.95,17.71 TH.VCC 78.08,17.59 79.45,16.21 79.45,6.96 78.33,6.96 CH1.VCC 78.2,6.96 75.7,6.96 CH2.VCC 75.58,6.96 71.2,6.96 CH3.VCC

### Text on the board
tPlace: #612 | Rev.1.1.3 | GND | RX | TX | Designed in Aizu